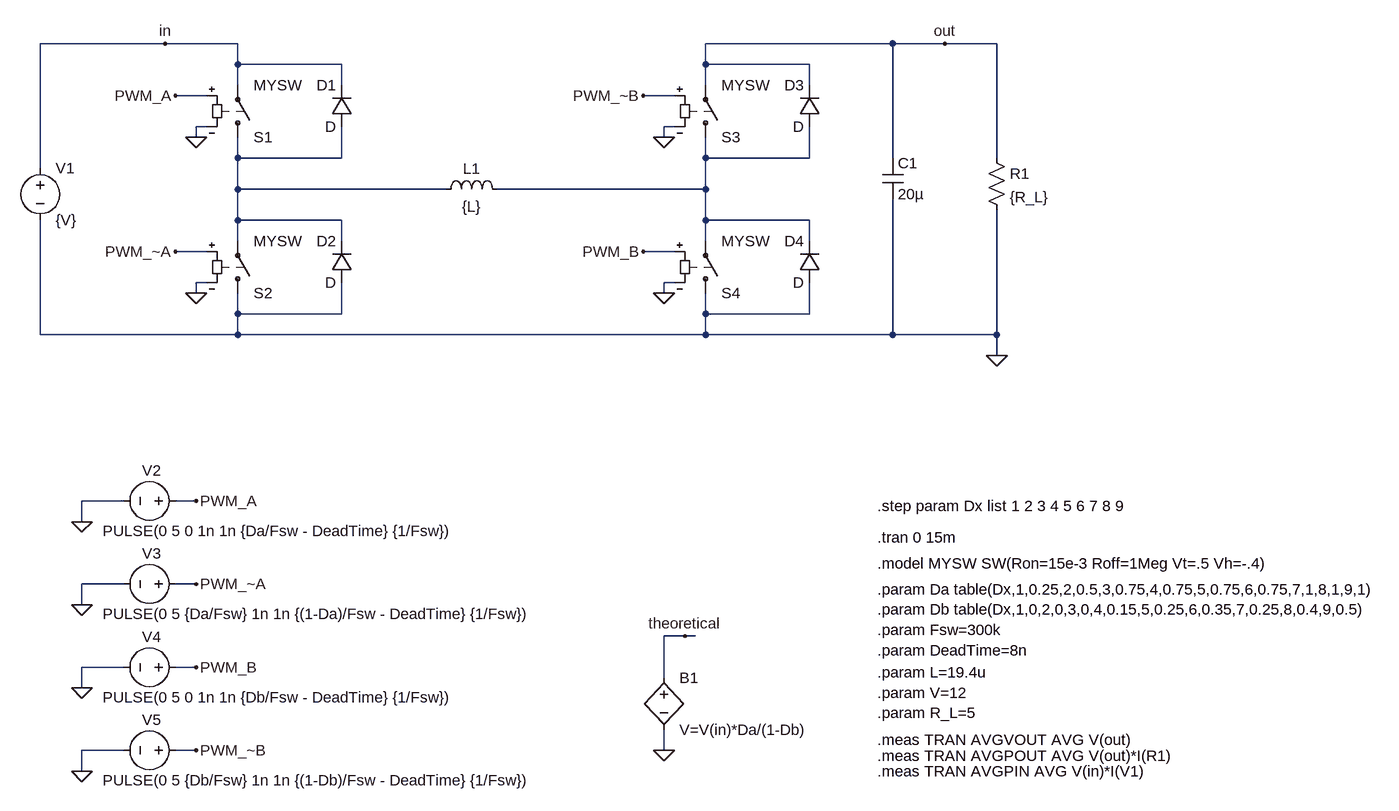
[diagram p0: schematic 4SW_BB_ideal.asc]
4SW_BB_ideal.asc, the LTspice schematic file:
Version 4
SHEET 1 2052 1424
WIRE -16 16 -208 16
WIRE 96 16 -16 16
WIRE 1104 16 816 16
WIRE 1184 16 1104 16
WIRE 1264 16 1184 16
WIRE 96 48 96 16
WIRE 256 48 96 48
WIRE 816 48 816 16
WIRE 976 48 816 48
WIRE 96 80 96 48
WIRE 256 80 256 48
WIRE 816 80 816 48
WIRE 976 80 976 48
WIRE 48 96 0 96
WIRE 768 96 720 96
WIRE 48 144 32 144
WIRE 768 144 752 144
WIRE 32 160 32 144
WIRE 752 160 752 144
WIRE 96 192 96 160
WIRE 256 192 256 144
WIRE 256 192 96 192
WIRE 816 192 816 160
WIRE 976 192 976 144
WIRE 976 192 816 192
WIRE 1104 192 1104 16
WIRE 1264 192 1264 16
WIRE -208 208 -208 16
WIRE 96 240 96 192
WIRE 416 240 96 240
WIRE 816 240 816 192
WIRE 816 240 496 240
WIRE 96 288 96 240
WIRE 256 288 96 288
WIRE 816 288 816 240
WIRE 976 288 816 288
WIRE 96 320 96 288
WIRE 256 320 256 288
WIRE 816 320 816 288
WIRE 976 320 976 288
WIRE 48 336 0 336
WIRE 768 336 720 336
WIRE 48 384 32 384
WIRE 768 384 752 384
WIRE 32 400 32 384
WIRE 752 400 752 384
WIRE 96 432 96 400
WIRE 256 432 256 384
WIRE 256 432 96 432
WIRE 816 432 816 400
WIRE 976 432 976 384
WIRE 976 432 816 432
WIRE -208 464 -208 288
WIRE 96 464 96 432
WIRE 96 464 -208 464
WIRE 816 464 816 432
WIRE 816 464 96 464
WIRE 1104 464 1104 256
WIRE 1104 464 816 464
WIRE 1264 464 1264 272
WIRE 1264 464 1104 464
WIRE 1264 496 1264 464
WIRE -80 720 -144 720
WIRE 32 720 0 720
WIRE -144 752 -144 720
WIRE -80 848 -144 848
WIRE 32 848 0 848
WIRE -144 880 -144 848
WIRE 784 928 752 928
WIRE 800 928 784 928
WIRE -80 976 -144 976
WIRE 32 976 0 976
WIRE 752 992 752 928
WIRE -144 1008 -144 976
WIRE -80 1104 -144 1104
WIRE 32 1104 0 1104
WIRE 752 1104 752 1072
WIRE -144 1136 -144 1104
FLAG -144 752 0
FLAG 32 720 PWM_A
FLAG -144 880 0
FLAG 32 848 PWM_~A
FLAG -144 1008 0
FLAG 32 976 PWM_B
FLAG -144 1136 0
FLAG 32 1104 PWM_~B
FLAG 0 96 PWM_A
FLAG 0 336 PWM_~A
FLAG 720 336 PWM_B
FLAG 720 96 PWM_~B
FLAG 32 160 0
FLAG 32 400 0
FLAG 752 400 0
FLAG 752 160 0
FLAG 1264 496 0
FLAG -16 16 in
FLAG 1184 16 out
FLAG 752 1104 0
FLAG 784 928 theoretical
SYMBOL sw 96 176 M180
SYMATTR InstName S1
SYMATTR Value MYSW
SYMBOL sw 96 416 M180
SYMATTR InstName S2
SYMATTR Value MYSW
SYMBOL sw 816 176 M180
SYMATTR InstName S3
SYMATTR Value MYSW
SYMBOL sw 816 416 M180
SYMATTR InstName S4
SYMATTR Value MYSW
SYMBOL ind 400 256 R270
WINDOW 0 32 56 VTop 2
WINDOW 3 5 56 VBottom 2
SYMATTR InstName L1
SYMATTR Value {L}
SYMBOL cap 1088 192 R0
SYMATTR InstName C1
SYMATTR Value 20µ
SYMBOL res 1248 176 R0
SYMATTR InstName R1
SYMATTR Value {R_L}
SYMBOL diode 272 144 R180
WINDOW 0 24 64 Left 2
WINDOW 3 24 0 Left 2
SYMATTR InstName D1
SYMBOL diode 272 384 R180
WINDOW 0 24 64 Left 2
WINDOW 3 24 0 Left 2
SYMATTR InstName D2
SYMBOL diode 992 144 R180
WINDOW 0 24 64 Left 2
WINDOW 3 24 0 Left 2
SYMATTR InstName D3
SYMBOL diode 992 384 R180
WINDOW 0 24 64 Left 2
WINDOW 3 24 0 Left 2
SYMATTR InstName D4
SYMBOL voltage -208 192 R0
WINDOW 123 0 0 Left 0
WINDOW 39 0 0 Left 0
SYMATTR InstName V1
SYMATTR Value {V}
SYMBOL voltage 16 720 R90
WINDOW 3 46 128 VLeft 2
WINDOW 123 0 0 Left 0
WINDOW 39 0 0 Left 0
WINDOW 0 -47 38 VRight 2
SYMATTR Value PULSE(0 5 0 1n 1n {Da/Fsw - DeadTime} {1/Fsw})
SYMATTR InstName V2
SYMBOL voltage 16 848 R90
WINDOW 3 46 128 VLeft 2
WINDOW 123 0 0 Left 0
WINDOW 39 0 0 Left 0
WINDOW 0 -47 38 VRight 2
SYMATTR Value PULSE(0 5 {Da/Fsw} 1n 1n {(1-Da)/Fsw - DeadTime} {1/Fsw})
SYMATTR InstName V3
SYMBOL voltage 16 976 R90
WINDOW 3 46 128 VLeft 2
WINDOW 123 0 0 Left 0
WINDOW 39 0 0 Left 0
WINDOW 0 -47 38 VRight 2
SYMATTR Value PULSE(0 5 0 1n 1n {Db/Fsw - DeadTime} {1/Fsw})
SYMATTR InstName V4
SYMBOL voltage 16 1104 R90
WINDOW 3 46 128 VLeft 2
WINDOW 123 0 0 Left 0
WINDOW 39 0 0 Left 0
WINDOW 0 -47 38 VRight 2
SYMATTR Value PULSE(0 5 {Db/Fsw} 1n 1n {(1-Db)/Fsw - DeadTime} {1/Fsw})
SYMATTR InstName V5
SYMBOL bv 752 976 R0
SYMATTR InstName B1
SYMATTR Value V=V(in)*Da/(1-Db)
TEXT 1080 776 Left 2 !.tran 0 15m
TEXT 1080 856 Left 2 !.param Da table(Dx,1,0.25,2,0.5,3,0.75,4,0.75,5,0.75,6,0.75,7,1,8,1,9,1)\n.param Db table(Dx,1,0,2,0,3,0,4,0.15,5,0.25,6,0.35,7,0.25,8,0.4,9,0.5)\n.param Fsw=300k\n.param DeadTime=8n
TEXT 1080 816 Left 2 !.model MYSW SW(Ron=15e-3 Roff=1Meg Vt=.5 Vh=-.4)
TEXT 1080 1088 Left 2 !.meas TRAN AVGVOUT AVG V(out)
TEXT 1080 1112 Left 2 !.meas TRAN AVGPOUT AVG V(out)*I(R1)
TEXT 1080 1136 Left 2 !.meas TRAN AVGPIN AVG V(in)*I(V1)
TEXT 1080 984 Left 2 !.param L=19.4u\n.param V=12\n.param R_L=5
TEXT 1080 728 Left 2 !.step param Dx list 1 2 3 4 5 6 7 8 9

The netlist it stands for:
* 4SW_BB_ideal.asc
S1 N001 in PWM_A 0 MYSW
S2 0 N001 PWM_~A 0 MYSW
S3 N002 out PWM_~B 0 MYSW
S4 0 N002 PWM_B 0 MYSW
L1 N001 N002 {L}
C1 out 0 20µ
R1 out 0 {R_L}
D1 N001 in D
D2 0 N001 D
D3 N002 out D
D4 0 N002 D
V1 in 0 {V}
V2 PWM_A 0 PULSE(0 5 0 1n 1n {Da/Fsw - DeadTime} {1/Fsw})
V3 PWM_~A 0 PULSE(0 5 {Da/Fsw} 1n 1n {(1-Da)/Fsw - DeadTime} {1/Fsw})
V4 PWM_B 0 PULSE(0 5 0 1n 1n {Db/Fsw - DeadTime} {1/Fsw})
V5 PWM_~B 0 PULSE(0 5 {Db/Fsw} 1n 1n {(1-Db)/Fsw - DeadTime} {1/Fsw})
B1 theoretical 0 V=V(in)*Da/(1-Db)
.model D D
.lib standard.dio
.tran 0 15m
.param Da table(Dx,1,0.25,2,0.5,3,0.75,4,0.75,5,0.75,6,0.75,7,1,8,1,9,1)
.param Db table(Dx,1,0,2,0,3,0,4,0.15,5,0.25,6,0.35,7,0.25,8,0.4,9,0.5)
.param Fsw=300k
.param DeadTime=8n
.model MYSW SW(Ron=15e-3 Roff=1Meg Vt=.5 Vh=-.4)
.meas TRAN AVGVOUT AVG V(out)
.meas TRAN AVGPOUT AVG V(out)*I(R1)
.meas TRAN AVGPIN AVG V(in)*I(V1)
.param L=19.4u
.param V=12
.param R_L=5
.step param Dx list 1 2 3 4 5 6 7 8 9
.backanno
.end